# Altium project bailey-x.PrjPcb (part 4 of 8)

## Sheet MIXER.SchDoc
size Letter; DrawnBy: Titan Yuan; SheetNumber: 4; SheetTotal: 9
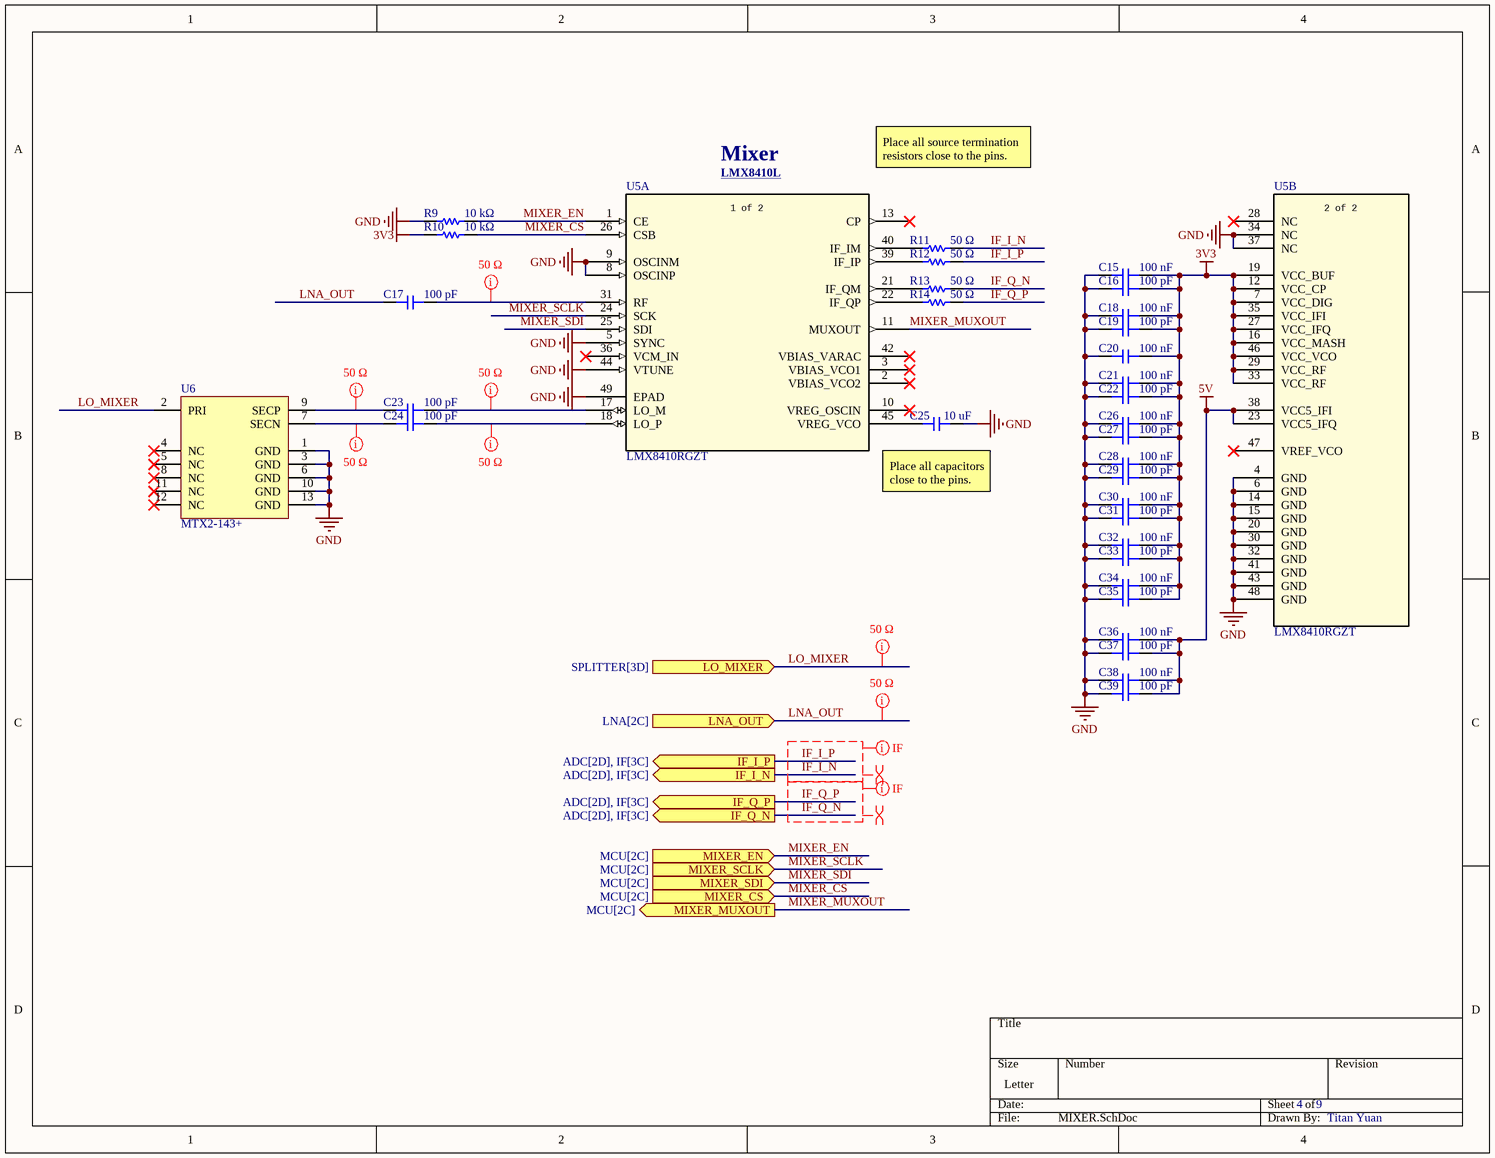
[diagram p3: MIXER.SchDoc]

### Parts
C15  100 nF  [CAP_0402]
C16  100 pF  [CAP_0402]
C17  100 pF  [CAP_0402]
C18  100 nF  [CAP_0402]
C19  100 pF  [CAP_0402]
C20  100 nF  [CAP_0402]
C21  100 nF  [CAP_0402]
C22  100 pF  [CAP_0402]
C23  100 pF  [CAP_0402]
C24  100 pF  [CAP_0402]
C25  10 uF  [CAP_0603]
C26  100 nF  [CAP_0402]
C27  100 pF  [CAP_0402]
C28  100 nF  [CAP_0402]
C29  100 pF  [CAP_0402]
C30  100 nF  [CAP_0402]
C31  100 pF  [CAP_0402]
C32  100 nF  [CAP_0402]
C33  100 pF  [CAP_0402]
C34  100 nF  [CAP_0402]
C35  100 pF  [CAP_0402]
C36  100 nF  [CAP_0402]
C37  100 pF  [CAP_0402]
C38  100 nF  [CAP_0402]
C39  100 pF  [CAP_0402]
R9  10 kΩ  [RES_0402]
R10  10 kΩ  [RES_0402]
R11  50 Ω  [RES_0402]
R12  50 Ω  [RES_0402]
R13  50 Ω  [RES_0402]
R14  50 Ω  [RES_0402]
U5  LMX8410RGZT  [RGZ48_TEX]  (parts A,B of 2)
U6  MTX2-143+  [PL-497]

### Ports
IF_I_N (out, see ADC[2D], IF[3C]), IF_I_P (out, see ADC[2D], IF[3C]), IF_Q_N (out, see ADC[2D], IF[3C]), IF_Q_P (out, see ADC[2D], IF[3C]), LNA_OUT (in, see LNA[2C]), LO_MIXER (in, see SPLITTER[3D]), MIXER_CS (in, see MCU[2C]), MIXER_EN (in, see MCU[2C]), MIXER_MUXOUT (out, see MCU[2C]), MIXER_SCLK (in, see MCU[2C]), MIXER_SDI (in, see MCU[2C])

### Nets
3V3: C15.2 C16.1 C18.2 C19.1 C20.2 C21.2 C22.1 C26.2 C27.1 C28.2 C29.1 C30.2 C31.1 C32.2 C33.1 C34.2 C35.1 R10.2 U5.7(VCC_DIG) U5.12(VCC_CP) U5.16(VCC_MASH) U5.19(VCC_BUF) U5.27(VCC_IFQ) U5.29(VCC_RF) U5.33(VCC_RF) U5.35(VCC_IFI) U5.46(VCC_VCO)
5V: C36.2 C37.1 C38.2 C39.1 U5.23(VCC5_IFQ) U5.38(VCC5_IFI)
GND: C15.1 C16.2 C18.1 C19.2 C20.1 C21.1 C22.2 C25.1 C26.1 C27.2 C28.1 C29.2 C30.1 C31.2 C32.1 C33.2 C34.1 C35.2 C36.1 C37.2 C38.1 C39.2 R9.2 U5.4(GND) U5.5(SYNC) U5.6(GND) U5.8(OSCINP) U5.9(OSCINM) U5.14(GND) U5.15(GND) U5.20(GND) U5.30(GND) U5.32(GND) U5.34(NC) U5.37(NC) U5.41(GND) U5.43(GND) U5.44(VTUNE) U5.48(GND) U5.49(EPAD) U6.1(GND) U6.3(GND) U6.6(GND) U6.10(GND) U6.13(GND)
IF_I_N: R11.1 ; port IF_I_N  [project net IF_I_EXT_N]
IF_I_P: R12.1 ; port IF_I_P  [project net IF_I_EXT_P]
IF_Q_N: R13.1 ; port IF_Q_N  [project net IF_Q_EXT_N]
IF_Q_P: R14.1 ; port IF_Q_P  [project net IF_Q_EXT_P]
LNA_OUT: C17.2 ; port LNA_OUT
LO_MIXER: U6.2(PRI) ; port LO_MIXER
MIXER_CS: R10.1 U5.26(CSB) ; port MIXER_CS
MIXER_EN: R9.1 U5.1(CE) ; port MIXER_EN
MIXER_MUXOUT: U5.11(MUXOUT) ; port MIXER_MUXOUT
MIXER_SCLK: U5.24(SCK) ; port MIXER_SCLK  [project net ADC_SPI_CLK]
MIXER_SDI: U5.25(SDI) ; port MIXER_SDI  [project net ADC_SPI_MOSI]
NetC17_1: C17.1 U5.31(RF)
NetC23_1: C23.1 U5.17(LO_M)
NetC23_2: C23.2 U6.9(SECP)
NetC24_1: C24.1 U5.18(LO_P)
NetC24_2: C24.2 U6.7(SECN)
NetC25_2: C25.2 U5.45(VREG_VCO)
NetR11_2: R11.2 U5.40(IF_IM)
NetR12_2: R12.2 U5.39(IF_IP)
NetR13_2: R13.2 U5.21(IF_QM)
NetR14_2: R14.2 U5.22(IF_QP)

Not connected (* = marked no-connect by the designer): U5 2(VBIAS_VCO2)* 3(VBIAS_VCO1)* 10(VREG_OSCIN)* 13(CP)* 28(NC)* 36(VCM_IN)* 42(VBIAS_VARAC)* 47(VREF_VCO)*; U6 4(NC)* 5(NC)* 8(NC)* 11(NC)* 12(NC)*

### Layout directives
net class 50 Ω: LNA_OUT, LO_MIXER, NetC17_1, NetC23_1, NetC23_2, NetC24_1, NetC24_2
differential pair: IF_I_N, IF_I_P, IF_Q_N, IF_Q_P
mark named IF: IF_I_N, IF_I_P, IF_Q_N, IF_Q_P

### Notes on the sheet
- Mixer
- Place all source termination resistors close to the pins.
- (near U5) LMX8410L <https://www.ti.com/product/LMX8410L>
- Place all capacitors close to the pins.
- (in symbol LMX8410RGZT, part A) 1 of 2
- (in symbol LMX8410RGZT, part B) 2 of 2

### Library data of the parts
C15 C18 C20 C21 C26 C28 C30 C32 C34 C36 C38 = CAP: Ceramic Capacitor, Ceramic, 50V, 10% +Tol, 10% -Tol, X7R, 15% TC, 0.1uF, Surface Mount, 0402; Manufacturer: Yageo; Manufacturer Part Number: CC0402KPX7R9BB104; Tolerance: +-10%; Value: 100nF; Voltage Rating: 50 V; Dielectric: Ceramic; Package Size: 0402; Supplier: DigiKey; Supplier Part Number: 13-CC0402KPX7R9BB104CT-ND; RoHS: Compliant; Category: Ceramic Capacitors; Stock: 40680; Pricing: 1=0.1, 10=0.053, 50=0.0364, 100=0.0313, 500=0.02292, 1000=0.02035, 2500=0.01764, 5000=0.01601 (USD); Case/Package: 0402; China RoHS: Compliant; Dielectric Material: Ceramic; Height: 500µm; Lead Free: Lead Free; Length: 1mm; Lifecycle Status: Production; Max Operating Temperature: 125°C; Min Operating Temperature: -55°C; Mounting Technology: Surface Mount; Number of Terminals: 2; REACH SVHC: Yes; Voltage Rating (DC): 50V; Width: 500µm; ComponentLink1URL: https://datasheet.octopart.com:443/CC0402KPX7R9BB104-Yageo-datasheet-177165144.pdf?src-supplier=IHS; ComponentLink1Description: https://datasheet.octopart.com:443/CC0402KPX7R9BB104-Yageo-datasheet-177165144.pdf?src-supplier=IHS; ComponentLink2URL: https://datasheet.octopart.com:443/CC0402KPX7R9BB104-Yageo-Group-datasheet-189192896.pdf?src-supplier=Future+Electronics; ComponentLink2Description: https://datasheet.octopart.com:443/CC0402KPX7R9BB104-Yageo-Group-datasheet-189192896.pdf?src-supplier=Future+Electronics; ComponentLink3URL: https://datasheet.octopart.com:443/CC0402KPX7R9BB104-Yageo-datasheet-181967134.pdf?src-supplier=Farnell; ComponentLink3Description: https://datasheet.octopart.com:443/CC0402KPX7R9BB104-Yageo-datasheet-181967134.pdf?src-supplier=Farnell; ComponentLink4URL: https://datasheet.octopart.com/Surface-Mount-Ceramic-Multilayer-Capacitors%3B-General-Purpose-%26-High-Capacitance-Class-2%2C-X7R-Yageo-datasheet-family-114.pdf; ComponentLink4Description: https://datasheet.octopart.com/Surface-Mount-Ceramic-Multilayer-Capacitors%3B-General-Purpose-%26-High-Capacitance-Class-2%2C-X7R-Yageo-datasheet-family-114.pdf; ComponentLink5URL: https://datasheet.octopart.com/CC0402KPX7R9BB104-Yageo-datasheet-10883670.pdf; ComponentLink5Description: https://datasheet.octopart.com/CC0402KPX7R9BB104-Yageo-datasheet-10883670.pdf; ComponentLink6URL: http://sigma.octopart.com:80/rohs_statement/Surface-Mount-Ceramic-Multilayer-Capacitors%3B-General-Purpose-%26-High-Capacitance-Class-2%2C-X7R-Yageo-family-124.pdf?src-supplier=Compliance+Statements; ComponentLink6Description: http://sigma.octopart.com:80/rohs_statement/Surface-Mount-Ceramic-Multilayer-Capacitors%3B-General-Purpose-%26-High-Capacitance-Class-2%2C-X7R-Yageo-family-124.pdf?src-supplier=Compliance+Statements; ComponentLink7URL: http://sigma.octopart.com:80/reach_statement/Surface-Mount-Ceramic-Multilayer-Capacitors%3B-General-Purpose-%26-High-Capacitance-Class-2%2C-X7R-Yageo-family-125.pdf?src-supplier=Compliance+Statements; ComponentLink7Description: http://sigma.octopart.com:80/reach_statement/Surface-Mount-Ceramic-Multilayer-Capacitors%3B-General-Purpose-%26-High-Capacitance-Class-2%2C-X7R-Yageo-family-125.pdf?src-supplier=Compliance+Statements; ComponentLink8URL: http://sigma.octopart.com:80/conflict_mineral_statement/Yageo-company-3.pdf?src-supplier=Compliance+Statements; ComponentLink8Description: http://sigma.octopart.com:80/conflict_mineral_statement/Yageo-company-3.pdf?src-supplier=Compliance+Statements; ComponentLink9URL: http://sigma.octopart.com:80/rohs_statement/Yageo-company-2.pdf?src-supplier=Compliance+Statements; ComponentLink9Description: http://sigma.octopart.com:80/rohs_statement/Yageo-company-2.pdf?src-supplier=Compliance+Statements
C16 C17 C19 C22-C24 C27 C29 C31 C33 C35 C37 C39 = CAP: 50V 100pF NP0 ±5% 0402 Multilayer Ceramic Capacitors MLCC - SMD/SMT ROHS; Manufacturer: Yageo; Manufacturer Part Number: CC0402JRNPO9BN101; Tolerance: +-5%; Insulation Resistance: 100GΩ; Temperature Coefficient: 30ppm/°C; Voltage Rating: 50 V; Dielectric: Ceramic; Package Size: 0402; Supplier: DigiKey; Supplier Part Number: 311-1024-1-ND; RoHS: Compliant; Category: Ceramic Capacitors; Stock: 3080901; Pricing: 1=0.08, 10=0.003, 10000=0.0032, 20000=0.0031, 30000=0.00304, 50000=0.00283, 70000=0.00282 (USD); Value: 100pF; Case/Package: 0402; Case Code (Imperial): 0402; Case Code (Metric): 1005; China RoHS: Compliant; Composition: Ceramic; Depth: 500µm; Dielectric Material: Ceramic; Halogen Free: Halogen Free; Height: 500µm; Lead Free: Lead Free; Length: 1mm; Lifecycle Status: Production; Max Operating Temperature: 125°C; Min Operating Temperature: -55°C; Mounting Technology: Surface Mount; Pins: 2; Number of Terminals: 2; Radiation Hardening: No; REACH SVHC: Yes; Schedule B: 8532240020, 8532240020|8532240020|8532240020|8532240020|8532240020|8532240020|8532240020|8532240020|8532240020|8532240020|8532240020|8532240020|8532240020|8532240020|8532240020|8532240020|8532240020|8532240020|8532240020|8532240020|8532240020|8532240020|8532240020|85; Termination: SMD/SMT; Thickness: 558.8µm; Voltage: 50V; Voltage Rating (AC): 50V; Voltage Rating (DC): 50V; Width: 500µm; ComponentLink1URL: https://datasheet.octopart.com:443/CC0402JRNPO9BN101-Yageo-datasheet-182140217.pdf?src-supplier=IHS; ComponentLink1Description: https://datasheet.octopart.com:443/CC0402JRNPO9BN101-Yageo-datasheet-182140217.pdf?src-supplier=IHS; ComponentLink2URL: https://datasheet.octopart.com:443/CC0402JRNPO9BN101-Yageo-datasheet-10406438.pdf?src-supplier=element14+APAC; ComponentLink2Description: https://datasheet.octopart.com:443/CC0402JRNPO9BN101-Yageo-datasheet-10406438.pdf?src-supplier=element14+APAC; ComponentLink3URL: https://datasheet.octopart.com:443/CC0402JRNPO9BN101-Yageo-datasheet-151948684.pdf?src-supplier=element14+APAC; ComponentLink3Description: https://datasheet.octopart.com:443/CC0402JRNPO9BN101-Yageo-datasheet-151948684.pdf?src-supplier=element14+APAC; ComponentLink4URL: https://datasheet.octopart.com:443/CC0402JRNPO9BN101-Yageo-datasheet-67645495.pdf?src-supplier=element14+APAC; ComponentLink4Description: https://datasheet.octopart.com:443/CC0402JRNPO9BN101-Yageo-datasheet-67645495.pdf?src-supplier=element14+APAC; ComponentLink5URL: https://datasheet.octopart.com:443/CC0402JRNPO9BN101-Yageo-datasheet-10882999.pdf?src-supplier=element14+APAC; ComponentLink5Description: https://datasheet.octopart.com:443/CC0402JRNPO9BN101-Yageo-datasheet-10882999.pdf?src-supplier=element14+APAC; ComponentLink6URL: https://datasheet.octopart.com:443/CC0402JRNPO9BN101-Yageo-datasheet-78855684.pdf?src-supplier=Upverter; ComponentLink6Description: https://datasheet.octopart.com:443/CC0402JRNPO9BN101-Yageo-datasheet-78855684.pdf?src-supplier=Upverter; ComponentLink7URL: https://datasheet.octopart.com:443/CC0402JRNPO9BN101-Yageo-Group-datasheet-188689597.pdf?src-supplier=Farnell; ComponentLink7Description: https://datasheet.octopart.com:443/CC0402JRNPO9BN101-Yageo-Group-datasheet-188689597.pdf?src-supplier=Farnell; ComponentLink8URL: https://datasheet.octopart.com:443/CC0402JRNPO9BN101-Yageo-datasheet-10621397.pdf?src-supplier=Farnell; ComponentLink8Description: https://datasheet.octopart.com:443/CC0402JRNPO9BN101-Yageo-datasheet-10621397.pdf?src-supplier=Farnell; ComponentLink9URL: https://datasheet.octopart.com:443/CC0402JRNPO9BN101-Yageo-datasheet-65873193.pdf?src-supplier=Newark; ComponentLink9Description: https://datasheet.octopart.com:443/CC0402JRNPO9BN101-Yageo-datasheet-65873193.pdf?src-supplier=Newark; ComponentLink10URL: https://datasheet.octopart.com:443/CC0402JRNPO9BN101-Yageo-datasheet-5301394.pdf?src-supplier=Newark; ComponentLink10Description: https://datasheet.octopart.com:443/CC0402JRNPO9BN101-Yageo-datasheet-5301394.pdf?src-supplier=Newark; ComponentLink11URL: https://datasheet.octopart.com:443/CC0402JRNPO9BN101-Yageo-datasheet-182966517.pdf?src-supplier=Newark; ComponentLink11Description: https://datasheet.octopart.com:443/CC0402JRNPO9BN101-Yageo-datasheet-182966517.pdf?src-supplier=Newark; ComponentLink12URL: https://datasheet.octopart.com:443/CC0402JRNPO9BN101-Yageo-datasheet-137875056.pdf?src-supplier=Future+Electronics; ComponentLink12Description: https://datasheet.octopart.com:443/CC0402JRNPO9BN101-Yageo-datasheet-137875056.pdf?src-supplier=Future+Electronics; ComponentLink13URL: https://datasheet.octopart.com:443/CC0402JRNPO9BN101-Yageo-datasheet-136957424.pdf?src-supplier=Future+Electronics; ComponentLink13Description: https://datasheet.octopart.com:443/CC0402JRNPO9BN101-Yageo-datasheet-136957424.pdf?src-supplier=Future+Electronics; ComponentLink14URL: https://datasheet.octopart.com:443/CC0402JRNPO9BN101-Yageo-datasheet-137700082.pdf?src-supplier=Future+Electronics; ComponentLink14Description: https://datasheet.octopart.com:443/CC0402JRNPO9BN101-Yageo-datasheet-137700082.pdf?src-supplier=Future+Electronics; ComponentLink15URL: https://datasheet.octopart.com:443/CC0402JRNPO9BN101-Yageo-datasheet-62126864.pdf?src-supplier=Future+Electronics; ComponentLink15Description: https://datasheet.octopart.com:443/CC0402JRNPO9BN101-Yageo-datasheet-62126864.pdf?src-supplier=Future+Electronics; ComponentLink16URL: https://datasheet.octopart.com:443/CC0402JRNPO9BN101-Yageo-datasheet-62091628.pdf?src-supplier=Future+Electronics; ComponentLink16Description: https://datasheet.octopart.com:443/CC0402JRNPO9BN101-Yageo-datasheet-62091628.pdf?src-supplier=Future+Electronics; ComponentLink17URL: https://datasheet.octopart.com:443/CC0402JRNPO9BN101-Yageo-datasheet-24578986.pdf?src-supplier=Future+Electronics; ComponentLink17Description: https://datasheet.octopart.com:443/CC0402JRNPO9BN101-Yageo-datasheet-24578986.pdf?src-supplier=Future+Electronics; ComponentLink18URL: https://datasheet.octopart.com:443/CC0402JRNPO9BN101-Yageo-datasheet-16730043.pdf?src-supplier=Future+Electronics; ComponentLink18Description: https://datasheet.octopart.com:443/CC0402JRNPO9BN101-Yageo-datasheet-16730043.pdf?src-supplier=Future+Electronics; ComponentLink19URL: https://datasheet.octopart.com:443/CC0402JRNPO9BN101-Yageo-datasheet-12589826.pdf?src-supplier=Future+Electronics; ComponentLink19Description: https://datasheet.octopart.com:443/CC0402JRNPO9BN101-Yageo-datasheet-12589826.pdf?src-supplier=Future+Electronics; ComponentLink20URL: https://datasheet.octopart.com:443/CC0402JRNPO9BN101-Yageo-datasheet-8817079.pdf?src-supplier=element14; ComponentLink20Description: https://datasheet.octopart.com:443/CC0402JRNPO9BN101-Yageo-datasheet-8817079.pdf?src-supplier=element14; ComponentLink21URL: https://datasheet.octopart.com:443/CC0402JRNPO9BN101-Yageo-datasheet-8324240.pdf?src-supplier=element14; ComponentLink21Description: https://datasheet.octopart.com:443/CC0402JRNPO9BN101-Yageo-datasheet-8324240.pdf?src-supplier=element14; ComponentLink22URL: https://datasheet.octopart.com:443/CC0402JRNPO9BN101-Yageo-datasheet-504625.pdf?src-supplier=element14; ComponentLink22Description: https://datasheet.octopart.com:443/CC0402JRNPO9BN101-Yageo-datasheet-504625.pdf?src-supplier=element14; ComponentLink23URL: https://datasheet.octopart.com:443/CC0402JRNPO9BN101-Yageo-datasheet-5321569.pdf?src-supplier=element14; ComponentLink23Description: https://datasheet.octopart.com:443/CC0402JRNPO9BN101-Yageo-datasheet-5321569.pdf?src-supplier=element14; ComponentLink24URL: https://datasheet.octopart.com:443/CC0402JRNPO9BN101-Yageo-datasheet-68296204.pdf?src-supplier=Megastar; ComponentLink24Description: https://datasheet.octopart.com:443/CC0402JRNPO9BN101-Yageo-datasheet-68296204.pdf?src-supplier=Megastar; ComponentLink25URL: http://sigma.octopart.com:80/conflict_mineral_statement/Yageo-company-3.pdf?src-supplier=Compliance+Statements; ComponentLink25Description: http://sigma.octopart.com:80/conflict_mineral_statement/Yageo-company-3.pdf?src-supplier=Compliance+Statements; ComponentLink26URL: http://sigma.octopart.com:80/rohs_statement/Yageo-company-2.pdf?src-supplier=Compliance+Statements; ComponentLink26Description: http://sigma.octopart.com:80/rohs_statement/Yageo-company-2.pdf?src-supplier=Compliance+Statements
C25 = CAP: 10V 10uF X7R ±10% 0603 Multilayer Ceramic Capacitors MLCC - SMD/SMT ROHS; Manufacturer: Murata Electronics; Manufacturer Part Number: GRM188Z71A106KA73D; Manufacturer Lifecycle Status: IN PRODUCTION; Tolerance: +-10%; Value: 10µF; Voltage Rating: 10 V; Dielectric: Ceramic; Package Size: 0603; Supplier: DigiKey; Supplier Part Number: 490-GRM188Z71A106KA73DCT-ND; RoHS: Compliant; Category: Ceramic Capacitors; Stock: 395206; Pricing: 1=0.24, 10=0.141, 50=0.1016, 100=0.0903, 500=0.0767, 1000=0.07013 (USD); Case/Package: 0603; Dielectric Material: Ceramic; Export Control Classification Number (ECCN) Code: EAR99; Height: 800µm; Harmonized Tariff Schedule (HTS) Code: 8532.24.00.20; Introduction Date: 2017-02-21; Length: 1.6mm; Lifecycle Status: Production; Material: Ceramic; Max Operating Temperature: 125°C; Min Operating Temperature: -55°C; Mounting Technology: Surface Mount; Number of Terminals: 2; REACH SVHC: Yes; Schedule B: 8532240020, 8532240020|8532240020|8532240020|8532240020|8532240020; Thickness: 800µm; Voltage Rating (DC): 10V; Width: 800µm; ComponentLink1URL: https://datasheet.octopart.com:443/GRM188Z71A106KA73D-Murata-datasheet-141276001.pdf?src-supplier=Geoflip; ComponentLink1Description: https://datasheet.octopart.com:443/GRM188Z71A106KA73D-Murata-datasheet-141276001.pdf?src-supplier=Geoflip; ComponentLink2URL: https://datasheet.octopart.com:443/GRM188Z71A106KA73D-Murata-datasheet-165579666.pdf?src-supplier=TME; ComponentLink2Description: https://datasheet.octopart.com:443/GRM188Z71A106KA73D-Murata-datasheet-165579666.pdf?src-supplier=TME; ComponentLink3URL: https://datasheet.octopart.com:443/GRM188Z71A106KA73D-Murata-datasheet-140705911.pdf?src-supplier=Ciiva; ComponentLink3Description: https://datasheet.octopart.com:443/GRM188Z71A106KA73D-Murata-datasheet-140705911.pdf?src-supplier=Ciiva; ComponentLink4URL: https://datasheet.octopart.com:443/GRM188Z71A106KA73D-Murata-datasheet-138743429.pdf?src-supplier=Ciiva; ComponentLink4Description: https://datasheet.octopart.com:443/GRM188Z71A106KA73D-Murata-datasheet-138743429.pdf?src-supplier=Ciiva; ComponentLink5URL: http://sigma.octopart.com:80/reach_statement/Murata-company-16.pdf?src-supplier=Compliance+Statements; ComponentLink5Description: http://sigma.octopart.com:80/reach_statement/Murata-company-16.pdf?src-supplier=Compliance+Statements
R9 R10 = RES: Res Thick Film 0402 10K Ohm 1% 0.063W(1/16W) ±100ppm/C Pad SMD T/R; Manufacturer: Yageo; Manufacturer Part Number: RC0402FR-0710KL; Power Dissipation: 62.5mW; Power Rating: 63mW; Value: 10kΩ; Temperature Coefficient: 100ppm/°C; Voltage Rating: 50V; Tolerance: 1%; Package Size: 0402; Supplier: DigiKey; Supplier Part Number: 311-10.0KLRCT-ND; RoHS: Compliant; Category: Chip SMD Resistors; Stock: 9059080; Pricing: 1=0.1, 10=0.012, 25=0.0092, 50=0.0062, 100=0.0056, 250=0.00472, 500=0.00328, 10000=0.00204, 20000=0.00153 (USD); Case/Package: 0402; Case Code (Imperial): 0402; Case Code (Metric): 0402; China RoHS: Non-Compliant; Composition: Thick Film; Country of Origin: Mainland China, Taiwan; Depth: 500µm; Export Control Classification Number (ECCN) Code: EAR99; Height: 350µm; Harmonized Tariff Schedule (HTS) Code: 8533.21.00.30; Introduction Date: 2004-10-04; Lead Free: Lead Free; Lead Pitch: 200µm; Length: 1mm; Lifecycle Status: Production; Max Operating Temperature: 155°C; Military Standard: Not; Min Operating Temperature: -55°C; Mounting Technology: Surface Mount; Pins: 2; Number of Terminals: 2; Number of Terminations: 2; Packaging: Tape & Reel; REACH SVHC: Yes; Schedule B: 8533210045, 8533210045|8533210045|8533210045|8533210045|8533210045|8533210045|8533210045|8533210045|8533210045|8533210045|8533210045|8533210045|8533210045|8533210045, 8533210045|8533210045|8533210045|8533210045|8533210045|8533210045|8533210045|8533210045|8533210045|8533210045|8533210045|8533210045|8533210045|8533210045|8533210045, 8533210045|8533210045|8533210045|8533210045|8533210045|8533210045|8533210045|8533210045|8533210045|8533210045|8533210045|8533210045|8533210045|8533210045|8533210045|8533210045; Termination: SMD/SMT; Voltage Rating (DC): 50V; Width: 500µm; Working Voltage: 50V; ComponentLink1URL: https://datasheet.octopart.com:443/RC0402FR-0710KL-Yageo-datasheet-175887523.pdf?src-supplier=Newark; ComponentLink1Description: https://datasheet.octopart.com:443/RC0402FR-0710KL-Yageo-datasheet-175887523.pdf?src-supplier=Newark; ComponentLink2URL: https://datasheet.octopart.com:443/RC0402FR-0710KL-Yageo-datasheet-12531192.pdf?src-supplier=Newark; ComponentLink2Description: https://datasheet.octopart.com:443/RC0402FR-0710KL-Yageo-datasheet-12531192.pdf?src-supplier=Newark; ComponentLink3URL: https://datasheet.octopart.com:443/RC0402FR-0710KL-Yageo-datasheet-8324527.pdf?src-supplier=Newark; ComponentLink3Description: https://datasheet.octopart.com:443/RC0402FR-0710KL-Yageo-datasheet-8324527.pdf?src-supplier=Newark; ComponentLink4URL: https://datasheet.octopart.com:443/RC0402FR-0710KL-Yageo-datasheet-10408619.pdf?src-supplier=element14+APAC; ComponentLink4Description: https://datasheet.octopart.com:443/RC0402FR-0710KL-Yageo-datasheet-10408619.pdf?src-supplier=element14+APAC; ComponentLink5URL: https://datasheet.octopart.com:443/RC0402FR-0710KL-Yageo-datasheet-62067350.pdf?src-supplier=element14+APAC; ComponentLink5Description: https://datasheet.octopart.com:443/RC0402FR-0710KL-Yageo-datasheet-62067350.pdf?src-supplier=element14+APAC; ComponentLink6URL: https://datasheet.octopart.com:443/RC0402FR-0710KL-Yageo-datasheet-21426659.pdf?src-supplier=element14+APAC; ComponentLink6Description: https://datasheet.octopart.com:443/RC0402FR-0710KL-Yageo-datasheet-21426659.pdf?src-supplier=element14+APAC; ComponentLink7URL: https://datasheet.octopart.com:443/RC0402FR-0710KL-Yageo-datasheet-164759695.pdf?src-supplier=Upverter; ComponentLink7Description: https://datasheet.octopart.com:443/RC0402FR-0710KL-Yageo-datasheet-164759695.pdf?src-supplier=Upverter; ComponentLink8URL: https://datasheet.octopart.com:443/RC0402FR-0710KL-Yageo-datasheet-103092701.pdf?src-supplier=Upverter; ComponentLink8Description: https://datasheet.octopart.com:443/RC0402FR-0710KL-Yageo-datasheet-103092701.pdf?src-supplier=Upverter; ComponentLink9URL: https://sigma.octopart.com:443/138820526/technical_drawing/Yageo-RC0402FR-0710KL.pdf?src-supplier=Upverter; ComponentLink9Description: https://sigma.octopart.com:443/138820526/technical_drawing/Yageo-RC0402FR-0710KL.pdf?src-supplier=Upverter; ComponentLink10URL: https://datasheet.octopart.com:443/RC0402FR-0710KL-Yageo-datasheet-98239111.pdf?src-supplier=Upverter; ComponentLink10Description: https://datasheet.octopart.com:443/RC0402FR-0710KL-Yageo-datasheet-98239111.pdf?src-supplier=Upverter; ComponentLink11URL: https://datasheet.octopart.com:443/RC0402FR-0710KL-Yageo-datasheet-68298067.pdf?src-supplier=Upverter; ComponentLink11Description: https://datasheet.octopart.com:443/RC0402FR-0710KL-Yageo-datasheet-68298067.pdf?src-supplier=Upverter; ComponentLink12URL: https://datasheet.octopart.com:443/RC0402FR-0710KL-Yageo-datasheet-68297981.pdf?src-supplier=Upverter; ComponentLink12Description: https://datasheet.octopart.com:443/RC0402FR-0710KL-Yageo-datasheet-68297981.pdf?src-supplier=Upverter; ComponentLink13URL: https://datasheet.octopart.com:443/RC0402FR-0710KL-Yageo-datasheet-141435361.pdf?src-supplier=Upverter; ComponentLink13Description: https://datasheet.octopart.com:443/RC0402FR-0710KL-Yageo-datasheet-141435361.pdf?src-supplier=Upverter; ComponentLink14URL: https://datasheet.octopart.com:443/RC0402FR-0710KL-Yageo-datasheet-12509768.pdf?src-supplier=Upverter; ComponentLink14Description: https://datasheet.octopart.com:443/RC0402FR-0710KL-Yageo-datasheet-12509768.pdf?src-supplier=Upverter; ComponentLink15URL: https://datasheet.octopart.com:443/RC0402FR-0710KL-Yageo-Group-datasheet-190305687.pdf?src-supplier=Future+Electronics; ComponentLink15Description: https://datasheet.octopart.com:443/RC0402FR-0710KL-Yageo-Group-datasheet-190305687.pdf?src-supplier=Future+Electronics; ComponentLink16URL: https://datasheet.octopart.com:443/RC0402FR-0710KL-Yageo-datasheet-137700087.pdf?src-supplier=Future+Electronics; ComponentLink16Description: https://datasheet.octopart.com:443/RC0402FR-0710KL-Yageo-datasheet-137700087.pdf?src-supplier=Future+Electronics; ComponentLink17URL: https://datasheet.octopart.com:443/RC0402FR-0710KL-Yageo-datasheet-8324255.pdf?src-supplier=Future+Electronics; ComponentLink17Description: https://datasheet.octopart.com:443/RC0402FR-0710KL-Yageo-datasheet-8324255.pdf?src-supplier=Future+Electronics; ComponentLink18URL: https://datasheet.octopart.com:443/RC0402FR-0710KL-Yageo-datasheet-8329306.pdf?src-supplier=element14; ComponentLink18Description: https://datasheet.octopart.com:443/RC0402FR-0710KL-Yageo-datasheet-8329306.pdf?src-supplier=element14; ComponentLink19URL: https://datasheet.octopart.com:443/RC0402FR-0710KL-Yageo-datasheet-505231.pdf?src-supplier=element14; ComponentLink19Description: https://datasheet.octopart.com:443/RC0402FR-0710KL-Yageo-datasheet-505231.pdf?src-supplier=element14; ComponentLink20URL: https://datasheet.octopart.com:443/RC0402FR-0710KL-Yageo-datasheet-175423674.pdf?src-supplier=SOS+electronic; ComponentLink20Description: https://datasheet.octopart.com:443/RC0402FR-0710KL-Yageo-datasheet-175423674.pdf?src-supplier=SOS+electronic; ComponentLink21URL: https://datasheet.octopart.com:443/RC0402FR-0710KL-Yageo-datasheet-79472498.pdf?src-supplier=Megastar; ComponentLink21Description: https://datasheet.octopart.com:443/RC0402FR-0710KL-Yageo-datasheet-79472498.pdf?src-supplier=Megastar; ComponentLink22URL: https://datasheet.octopart.com/RC0402FR-0710KL-Yageo-datasheet-73766026.pdf; ComponentLink22Description: https://datasheet.octopart.com/RC0402FR-0710KL-Yageo-datasheet-73766026.pdf; ComponentLink23URL: http://sigma.octopart.com:80/conflict_mineral_statement/Yageo-company-3.pdf?src-supplier=Compliance+Statements; ComponentLink23Description: http://sigma.octopart.com:80/conflict_mineral_statement/Yageo-company-3.pdf?src-supplier=Compliance+Statements; ComponentLink24URL: http://sigma.octopart.com:80/rohs_statement/Yageo-company-2.pdf?src-supplier=Compliance+Statements; ComponentLink24Description: http://sigma.octopart.com:80/rohs_statement/Yageo-company-2.pdf?src-supplier=Compliance+Statements
R11-R14 = RES: 62.5mW Thin Film Resistor ±50ppm/℃ ±0.1% 50Ω 0402 Chip Resistor - Surface Mount ROHS; Manufacturer: Yageo; Manufacturer Part Number: RT0402BRE0750RL; Tolerance: +-0.1%; Power Rating: 1/16 W; Max Power Dissipation: 63mW; Temperature Coefficient: 50ppm/°C; Voltage Rating: 50V; Package Size: 0402; Supplier: DigiKey; Supplier Part Number: 13-RT0402BRE0750RLCT-ND; RoHS: Compliant; Category: Chip SMD Resistors; Stock: 104846; Pricing: 1=0.18, 10=0.076, 25=0.074, 50=0.0714, 100=0.0663, 250=0.05816, 500=0.0561, 1000=0.04564, 10000=0.05508, 20000=0.05304, 30000=0.04099, 50000=0.03992, 70000=0.03927, 100000=0.03862, 120000=0.03831, 240000=0.03778 (USD); Case/Package: 0402; China RoHS: Non-Compliant; Composition: Thin Film; Country of Origin: Mainland China; Export Control Classification Number (ECCN) Code: EAR99; Features: Moisture Resistant; Height: 350µm; Harmonized Tariff Schedule (HTS) Code: 8533.21.00.30; Introduction Date: 2017-09-12; Length: 990.6µm; Lifecycle Status: Production; Max Operating Temperature: 155°C; Min Operating Temperature: -55°C; Mounting Technology: Surface Mount; Number of Terminals: 2; Number of Terminations: 2; Packaging: Tape & Reel; Power Dissipation: 62.5mW; REACH SVHC: Yes; Value: 50Ω; Width: 508µm; Working Voltage: 50V; ComponentLink1URL: https://datasheet.octopart.com:443/RT0402BRE0750RL-Yageo-datasheet-169971040.pdf?src-supplier=Upverter; ComponentLink1Description: https://datasheet.octopart.com:443/RT0402BRE0750RL-Yageo-datasheet-169971040.pdf?src-supplier=Upverter; ComponentLink2URL: https://sigma.octopart.com:443/138820526/technical_drawing/Yageo-RT0402BRE0750RL.pdf?src-supplier=Upverter; ComponentLink2Description: https://sigma.octopart.com:443/138820526/technical_drawing/Yageo-RT0402BRE0750RL.pdf?src-supplier=Upverter; ComponentLink3URL: https://datasheet.octopart.com:443/RT0402BRE0750RL-Yageo-datasheet-96443642.pdf?src-supplier=IHS; ComponentLink3Description: https://datasheet.octopart.com:443/RT0402BRE0750RL-Yageo-datasheet-96443642.pdf?src-supplier=IHS; ComponentLink4URL: https://datasheet.octopart.com:443/RT0402BRE0750RL-Yageo-datasheet-176402239.pdf?src-supplier=Future+Electronics; ComponentLink4Description: https://datasheet.octopart.com:443/RT0402BRE0750RL-Yageo-datasheet-176402239.pdf?src-supplier=Future+Electronics; ComponentLink5URL: https://datasheet.octopart.com:443/RT0402BRE0750RL-Yageo-datasheet-166250672.pdf?src-supplier=Future+Electronics; ComponentLink5Description: https://datasheet.octopart.com:443/RT0402BRE0750RL-Yageo-datasheet-166250672.pdf?src-supplier=Future+Electronics; ComponentLink6URL: https://datasheet.octopart.com:443/RT0402BRE0750RL-Yageo-datasheet-141265893.pdf?src-supplier=ODG+(Origin+Data+Global); ComponentLink6Description: https://datasheet.octopart.com:443/RT0402BRE0750RL-Yageo-datasheet-141265893.pdf?src-supplier=ODG+(Origin+Data+Global); ComponentLink7URL: https://datasheet.octopart.com/RT0402BRE0750RL-Yageo-datasheet-86813807.pdf; ComponentLink7Description: https://datasheet.octopart.com/RT0402BRE0750RL-Yageo-datasheet-86813807.pdf; ComponentLink8URL: http://sigma.octopart.com:80/conflict_mineral_statement/Yageo-company-3.pdf?src-supplier=Compliance+Statements; ComponentLink8Description: http://sigma.octopart.com:80/conflict_mineral_statement/Yageo-company-3.pdf?src-supplier=Compliance+Statements; ComponentLink9URL: http://sigma.octopart.com:80/rohs_statement/Yageo-company-2.pdf?src-supplier=Compliance+Statements; ComponentLink9Description: http://sigma.octopart.com:80/rohs_statement/Yageo-company-2.pdf?src-supplier=Compliance+Statements
U5 = LMX8410RGZT: 4GHz~10GHz 19dB 11dB QFN-48-EP(7x7) RF Modulators / Demodulator ROHS; Manufacturer_Name: Texas Instruments; Manufacturer Lifecycle Status: ACTIVE; Frequency: 10GHz; Copyright: Copyright (C) 2026 Ultra Librarian. All rights reserved.; Manufacturer_Part_Number: LMX8410RGZT; Datasheet: https://www.ti.com/lit/gpn/lmx8410l; RefDes: RefDes; Type: Type; Supplier: DigiKey; Supplier Part Number: 296-53223-1-ND; Manufacturer: Texas Instruments; Manufacturer Part Number: LMX8410RGZT; RoHS: Compliant; Category: RF Receivers, Transceivers; Stock: 564; Pricing: 1=134.16, 10=113.249, 25=108.0276 (USD); Case/Package: VQFN; Height: 1mm; Length: 7mm; Lifecycle Status: Production; Pins: 48; Schedule B: 8542390000, 8542390000|8542390000|8542390000|8542390000|8542390000; Thickness: 900µm; Width: 7mm; ComponentLink1URL: https://sigma.octopart.com:443/49249797/technical_drawing/Texas-Instruments-LMX8410RGZT.pdf?src-supplier=Texas+Instruments; ComponentLink1Description: https://sigma.octopart.com:443/49249797/technical_drawing/Texas-Instruments-LMX8410RGZT.pdf?src-supplier=Texas+Instruments; ComponentLink2URL: https://octopart.com:443/opatz8j6/c1?t=OSmSJJdNyKSbWqEw0vn8SIgfjq11nLHjtGgfLHRXvwfeMgF3TY_W6V8cFA1iHYYIOxC0JB7bHbIc4ZhsozsVMJli3TD6MJfYLuuyT7qGQcay5ot-dpFL0YZnHF23ZUpECGlIaOqZYS-_--WhL5WwkmL1f5pSpJKV6lYnSunmmDMtuF41zkfeYuxpGUnPa8VU9glOm5OV5MJuk4URxeiUVA1vu6wi3GZ-eSUaVnHSNvkDjkEVzksepbqIECkZ51v6n-bDohaiCp0rJydrV8ZXqdVDfu5t9teVCchDSMKaAW-RKjs78W6r6rYCspQdRpOoggdynM_4PcQHvtaA5v4WWRiyBUJ58a966Hsb4g0B5WZD8S-QOJnlBY18ViVbJ0UPjo9Qt7-Z&src-supplier=Texas+Instruments; ComponentLink2Description: https://octopart.com:443/opatz8j6/c1?t=OSmSJJdNyKSbWqEw0vn8SIgfjq11nLHjtGgfLHRXvwfeMgF3TY_W6V8cFA1iHYYIOxC0JB7bHbIc4ZhsozsVMJli3TD6MJfYLuuyT7qGQcay5ot-dpFL0YZnHF23ZUpECGlIaOqZYS-_--WhL5WwkmL1f5pSpJKV6lYnSunmmDMtuF41zkfeYuxpGUnPa8VU9glOm5OV5MJuk4URxeiUVA1vu6wi3GZ-eSUaVnHSNvkDjkEVzksepbqIECkZ51v6n-bDohaiCp0rJydrV8ZXqdVDfu5t9teVCchDSMKaAW-RKjs78W6r6rYCspQdRpOoggdynM_4PcQHvtaA5v4WWRiyBUJ58a966Hsb4g0B5WZD8S-QOJnlBY18ViVbJ0UPjo9Qt7-Z&src-supplier=Texas+Instruments; ComponentLink3URL: https://datasheet.octopart.com:443/LMX8410RGZT-Texas-Instruments-datasheet-166594463.pdf?src-supplier=Augswan; ComponentLink3Description: https://datasheet.octopart.com:443/LMX8410RGZT-Texas-Instruments-datasheet-166594463.pdf?src-supplier=Augswan; ComponentLink4URL: http://sigma.octopart.com:80/reach_statement/Texas-Instruments-company-64.pdf?src-supplier=Compliance+Statements; ComponentLink4Description: http://sigma.octopart.com:80/reach_statement/Texas-Instruments-company-64.pdf?src-supplier=Compliance+Statements; ComponentLink5URL: http://sigma.octopart.com:80/conflict_mineral_statement/Texas-Instruments-company-63.pdf?src-supplier=Compliance+Statements; ComponentLink5Description: http://sigma.octopart.com:80/conflict_mineral_statement/Texas-Instruments-company-63.pdf?src-supplier=Compliance+Statements
U6 = MTX2-143+: RF Transformer, 5500MHz Min; Manufacturer: Mini-Circuits; Insertion Loss (dB): 2.5dB; Manufacturer Part Number: MTX2-143+; Supplier: DigiKey; Supplier Part Number: 3157-MTX2-143+CT-ND; RoHS: Compliant; Category: Transformers; Stock: 559; Pricing: 1=16.09, 20=3.7485 (USD); Export Control Classification Number (ECCN) Code: EAR99; Height: 890µm; Introduction Date: 2017-08-24; Length: 3mm; Lifecycle Status: Production; Max Operating Temperature: 85°C; Min Operating Temperature: -40°C; Mounting Technology: Surface Mount; Width: 3mm; ComponentLink1URL: https://datasheet.octopart.com:443/MTX2-143%2B-Mini-Circuits-datasheet-180702081.pdf?src-supplier=IHS; ComponentLink1Description: https://datasheet.octopart.com:443/MTX2-143%2B-Mini-Circuits-datasheet-180702081.pdf?src-supplier=IHS

## Sheet IF.SchDoc
size Letter; DrawnBy: Titan Yuan; SheetNumber: 5; SheetTotal: 9
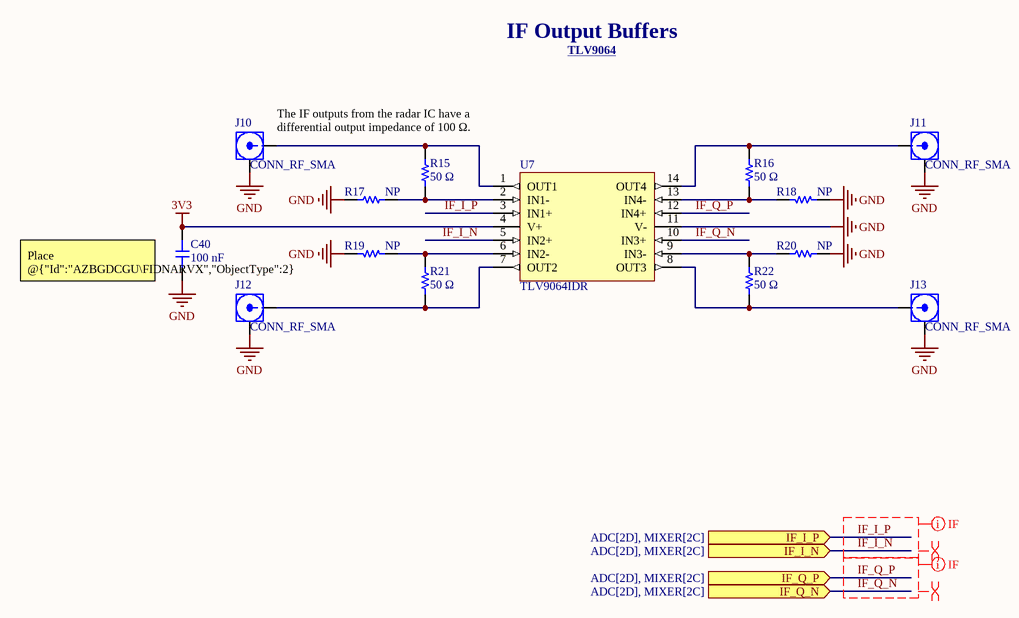
[diagram p4: IF.SchDoc]

### Parts
C40  100 nF  [CAP_0402]
J10  CONN_RF_SMA  [SMA-J-P-H-ST-TH1]
J11  CONN_RF_SMA  [SMA-J-P-H-ST-TH1]
J12  CONN_RF_SMA  [SMA-J-P-H-ST-TH1]
J13  CONN_RF_SMA  [SMA-J-P-H-ST-TH1]
R15  50 Ω  [RES_0603]
R16  50 Ω  [RES_0603]
R17  NP  [RES_0603]
R18  NP  [RES_0603]
R19  NP  [RES_0603]
R20  NP  [RES_0603]
R21  50 Ω  [RES_0603]
R22  50 Ω  [RES_0603]
U7  TLV9064IDR  [TLV9064IDR]

### Ports
IF_I_N (in, see ADC[2D], MIXER[2C]), IF_I_P (in, see ADC[2D], MIXER[2C]), IF_Q_N (in, see ADC[2D], MIXER[2C]), IF_Q_P (in, see ADC[2D], MIXER[2C])

### Nets
3V3: C40.2 U7.4(V+)
GND: C40.1 J10.2 J11.2 J12.2 J13.2 R17.2 R18.2 R19.2 R20.2 U7.11(V-)
IF_I_N: U7.5(IN2+) ; port IF_I_N  [project net IF_I_EXT_N]
IF_I_P: U7.3(IN1+) ; port IF_I_P  [project net IF_I_EXT_P]
IF_Q_N: U7.10(IN3+) ; port IF_Q_N  [project net IF_Q_EXT_N]
IF_Q_P: U7.12(IN4+) ; port IF_Q_P  [project net IF_Q_EXT_P]
NetJ10_1: J10.1 R15.2 U7.1(OUT1)
NetJ11_1: J11.1 R16.2 U7.14(OUT4)
NetJ12_1: J12.1 R21.2 U7.7(OUT2)
NetJ13_1: J13.1 R22.2 U7.8(OUT3)
NetR15_1: R15.1 R17.1 U7.2(IN1-)
NetR16_1: R16.1 R18.1 U7.13(IN4-)
NetR19_1: R19.1 R21.1 U7.6(IN2-)
NetR20_1: R20.1 R22.1 U7.9(IN3-)

### Layout directives
differential pair: IF_I_N, IF_I_P, IF_Q_N, IF_Q_P
mark named IF: IF_I_N, IF_I_P, IF_Q_N, IF_Q_P

### Notes on the sheet
- IF Output Buffers
- TLV9064 <https://www.ti.com/product/TLV9064>
- The IF outputs from the radar IC have a differential output impedance of 100 Ω.
- (near C40) Place @{"Id":"AZBGDCGU\FIDNARVX","ObjectType":2} as close to the device as possible.

### Library data of the parts
C40 = CAP: as C15 on sheet MIXER; Voltage Rating: 50 V; Dielectric: Ceramic; Package Size: 0402; Supplier: DigiKey; Supplier Part Number: 13-CC0402KPX7R9BB104CT-ND; RoHS: Compliant; Category: Ceramic Capacitors; Stock: 40680; Pricing: 1=0.1, 10=0.053, 50=0.0364, 100=0.0313, 500=0.02292, 1000=0.02035, 2500=0.01764, 5000=0.01601 (USD); Case/Package: 0402; China RoHS: Compliant; Dielectric Material: Ceramic; Height: 500µm; Lead Free: Lead Free; Length: 1mm; Lifecycle Status: Production; Max Operating Temperature: 125°C; Min Operating Temperature: -55°C; Mounting Technology: Surface Mount; Number of Terminals: 2; REACH SVHC: Yes; Voltage Rating (DC): 50V; Width: 500µm; ComponentLink1URL: https://datasheet.octopart.com:443/CC0402KPX7R9BB104-Yageo-datasheet-177165144.pdf?src-supplier=IHS; ComponentLink1Description: https://datasheet.octopart.com:443/CC0402KPX7R9BB104-Yageo-datasheet-177165144.pdf?src-supplier=IHS; ComponentLink2URL: https://datasheet.octopart.com:443/CC0402KPX7R9BB104-Yageo-Group-datasheet-189192896.pdf?src-supplier=Future+Electronics; ComponentLink2Description: https://datasheet.octopart.com:443/CC0402KPX7R9BB104-Yageo-Group-datasheet-189192896.pdf?src-supplier=Future+Electronics; ComponentLink3URL: https://datasheet.octopart.com:443/CC0402KPX7R9BB104-Yageo-datasheet-181967134.pdf?src-supplier=Farnell; ComponentLink3Description: https://datasheet.octopart.com:443/CC0402KPX7R9BB104-Yageo-datasheet-181967134.pdf?src-supplier=Farnell; ComponentLink4URL: https://datasheet.octopart.com/Surface-Mount-Ceramic-Multilayer-Capacitors%3B-General-Purpose-%26-High-Capacitance-Class-2%2C-X7R-Yageo-datasheet-family-114.pdf; ComponentLink4Description: https://datasheet.octopart.com/Surface-Mount-Ceramic-Multilayer-Capacitors%3B-General-Purpose-%26-High-Capacitance-Class-2%2C-X7R-Yageo-datasheet-family-114.pdf; ComponentLink5URL: https://datasheet.octopart.com/CC0402KPX7R9BB104-Yageo-datasheet-10883670.pdf; ComponentLink5Description: https://datasheet.octopart.com/CC0402KPX7R9BB104-Yageo-datasheet-10883670.pdf; ComponentLink6URL: http://sigma.octopart.com:80/rohs_statement/Surface-Mount-Ceramic-Multilayer-Capacitors%3B-General-Purpose-%26-High-Capacitance-Class-2%2C-X7R-Yageo-family-124.pdf?src-supplier=Compliance+Statements; ComponentLink6Description: http://sigma.octopart.com:80/rohs_statement/Surface-Mount-Ceramic-Multilayer-Capacitors%3B-General-Purpose-%26-High-Capacitance-Class-2%2C-X7R-Yageo-family-124.pdf?src-supplier=Compliance+Statements; ComponentLink7URL: http://sigma.octopart.com:80/reach_statement/Surface-Mount-Ceramic-Multilayer-Capacitors%3B-General-Purpose-%26-High-Capacitance-Class-2%2C-X7R-Yageo-family-125.pdf?src-supplier=Compliance+Statements; ComponentLink7Description: http://sigma.octopart.com:80/reach_statement/Surface-Mount-Ceramic-Multilayer-Capacitors%3B-General-Purpose-%26-High-Capacitance-Class-2%2C-X7R-Yageo-family-125.pdf?src-supplier=Compliance+Statements; ComponentLink8URL: http://sigma.octopart.com:80/conflict_mineral_statement/Yageo-company-3.pdf?src-supplier=Compliance+Statements; ComponentLink8Description: http://sigma.octopart.com:80/conflict_mineral_statement/Yageo-company-3.pdf?src-supplier=Compliance+Statements; ComponentLink9URL: http://sigma.octopart.com:80/rohs_statement/Yageo-company-2.pdf?src-supplier=Compliance+Statements; ComponentLink9Description: http://sigma.octopart.com:80/rohs_statement/Yageo-company-2.pdf?src-supplier=Compliance+Statements
J10-J13 = CONN_RF_SMA: RF / Coaxial Connector, SMA Coaxial, Straight Jack, Through Hole Vertical, 50 ohm; Manufacturer: Samtec; Manufacturer Lifecycle Status: PRODUCTION; Maximum Frequency: 20 GHz; Body Material: Brass; Body Plating: Gold; Connector Type: SMA, Socket; Dielectric Material: PTFE; Frequency: 20GHz; Gender: Female; Impedance: 50Ω; Clock Frequency: 6GHz; Number of Contacts: 1; Voltage Rating: 335V; Manufacturer Part Number: SMA-J-P-H-ST-TH1; Supplier: DigiKey; Supplier Part Number: SAM8971-ND; RoHS: Compliant; Category: RF / Coaxial Connectors; Stock: 25259; Pricing: 1=2.75, 10=2.333, 25=2.1864, 50=2.0818, 100=1.9823, 250=1.85816, 500=1.76948, 1000=1.68505, 2500=1.584 (USD); Case/Package: SMA; Contact Material: Gold; Contact Plating: Gold; Depth: 7mm; Fastening Type: Threaded; Height: 9.81mm; Housing Color: Gold; Insulation Material: Polytetrafluoroethylene; Length: 7mm; Lifecycle Status: Production; Max Operating Temperature: 125°C; Min Operating Temperature: -65°C; Mounting Technology: Flanges, Panel, Through Hole; Orientation: Straight; Radiation Hardening: No; Termination: Solder; ComponentLink1URL: https://datasheet.octopart.com:443/SMA-J-P-H-ST-TH1-Samtec-datasheet-104427088.pdf?src-supplier=Upverter; ComponentLink1Description: https://datasheet.octopart.com:443/SMA-J-P-H-ST-TH1-Samtec-datasheet-104427088.pdf?src-supplier=Upverter; ComponentLink2URL: https://sigma.octopart.com:443/97281565/technical_drawing/Samtec-SMA-J-P-H-ST-TH1.pdf?src-supplier=Upverter; ComponentLink2Description: https://sigma.octopart.com:443/97281565/technical_drawing/Samtec-SMA-J-P-H-ST-TH1.pdf?src-supplier=Upverter; ComponentLink3URL: https://datasheet.octopart.com:443/SMA-J-P-H-ST-TH1-Samtec-datasheet-97281556.pdf?src-supplier=Electro+Sonic; ComponentLink3Description: https://datasheet.octopart.com:443/SMA-J-P-H-ST-TH1-Samtec-datasheet-97281556.pdf?src-supplier=Electro+Sonic; ComponentLink4URL: https://datasheet.octopart.com:443/SMA-J-P-H-ST-TH1-Samtec-datasheet-157420883.pdf?src-supplier=Newark; ComponentLink4Description: https://datasheet.octopart.com:443/SMA-J-P-H-ST-TH1-Samtec-datasheet-157420883.pdf?src-supplier=Newark; ComponentLink5URL: https://datasheet.octopart.com:443/SMA-J-P-H-ST-TH1-Samtec-datasheet-180264035.pdf?src-supplier=JRH+Electronics; ComponentLink5Description: https://datasheet.octopart.com:443/SMA-J-P-H-ST-TH1-Samtec-datasheet-180264035.pdf?src-supplier=JRH+Electronics; ComponentLink6URL: https://datasheet.octopart.com:443/SMA-J-P-H-ST-TH1-Samtec-datasheet-159753816.pdf?src-supplier=Toby+Electronics; ComponentLink6Description: https://datasheet.octopart.com:443/SMA-J-P-H-ST-TH1-Samtec-datasheet-159753816.pdf?src-supplier=Toby+Electronics; ComponentLink7URL: https://datasheet.octopart.com:443/SMA-J-P-H-ST-TH1-Samtec-datasheet-116536392.pdf?src-supplier=Toby+Electronics; ComponentLink7Description: https://datasheet.octopart.com:443/SMA-J-P-H-ST-TH1-Samtec-datasheet-116536392.pdf?src-supplier=Toby+Electronics; ComponentLink8URL: https://datasheet.octopart.com:443/SMA-J-P-H-ST-TH1-Samtec-datasheet-116536236.pdf?src-supplier=Toby+Electronics; ComponentLink8Description: https://datasheet.octopart.com:443/SMA-J-P-H-ST-TH1-Samtec-datasheet-116536236.pdf?src-supplier=Toby+Electronics
R15 R16 R21 R22 = RES: 100mW Thin Film Resistor ±50ppm/℃ ±0.1% 50Ω 0603 Chip Resistor - Surface Mount ROHS; Manufacturer: Yageo; Manufacturer Part Number: RT0603BRE0750RL; Power Rating: 1/10 W; Temperature Coefficient: 50ppm/°C; Working Voltage: 75V; Tolerance: 0.1%; Package Size: 0603; Supplier: DigiKey; Supplier Part Number: 13-RT0603BRE0750RLCT-ND; RoHS: Compliant; Category: Chip SMD Resistors; Stock: 31948; Pricing: 1=0.1, 10=0.085, 50=0.0746, 100=0.0704, 500=0.06184 (USD); Case/Package: 0603; China RoHS: Non-Compliant; Composition: Thin Film; Country of Origin: Mainland China, Taiwan; Export Control Classification Number (ECCN) Code: EAR99; Features: Moisture Resistant; Height: 558.8µm; Harmonized Tariff Schedule (HTS) Code: 8533.21.00.30; Introduction Date: 2017-09-12; Length: 1.6002mm; Lifecycle Status: Production; Max Operating Temperature: 155°C; Max Power Dissipation: 100mW; Min Operating Temperature: -55°C; Mounting Technology: Surface Mount; Number of Terminals: 2; Number of Terminations: 2; Packaging: Tape & Reel; REACH SVHC: Yes; Value: 50Ω; Width: 787.4µm; ComponentLink1URL: https://datasheet.octopart.com:443/RT0603BRE0750RL-Yageo-datasheet-96443642.pdf?src-supplier=IHS; ComponentLink1Description: https://datasheet.octopart.com:443/RT0603BRE0750RL-Yageo-datasheet-96443642.pdf?src-supplier=IHS; ComponentLink2URL: https://datasheet.octopart.com:443/RT0603BRE0750RL-Yageo-datasheet-176402239.pdf?src-supplier=Future+Electronics; ComponentLink2Description: https://datasheet.octopart.com:443/RT0603BRE0750RL-Yageo-datasheet-176402239.pdf?src-supplier=Future+Electronics; ComponentLink3URL: https://datasheet.octopart.com:443/RT0603BRE0750RL-Yageo-datasheet-169971040.pdf?src-supplier=Future+Electronics; ComponentLink3Description: https://datasheet.octopart.com:443/RT0603BRE0750RL-Yageo-datasheet-169971040.pdf?src-supplier=Future+Electronics; ComponentLink4URL: https://datasheet.octopart.com:443/RT0603BRE0750RL-Yageo-datasheet-166250672.pdf?src-supplier=Future+Electronics; ComponentLink4Description: https://datasheet.octopart.com:443/RT0603BRE0750RL-Yageo-datasheet-166250672.pdf?src-supplier=Future+Electronics; ComponentLink5URL: https://datasheet.octopart.com:443/RT0603BRE0750RL-Yageo-datasheet-137700930.pdf?src-supplier=Future+Electronics; ComponentLink5Description: https://datasheet.octopart.com:443/RT0603BRE0750RL-Yageo-datasheet-137700930.pdf?src-supplier=Future+Electronics; ComponentLink6URL: https://datasheet.octopart.com:443/RT0603BRE0750RL-Yageo-Group-datasheet-141265893.pdf?src-supplier=ODG+(Origin+Data+Global); ComponentLink6Description: https://datasheet.octopart.com:443/RT0603BRE0750RL-Yageo-Group-datasheet-141265893.pdf?src-supplier=ODG+(Origin+Data+Global); ComponentLink7URL: https://datasheet.octopart.com/RT0603BRE0750RL-Yageo-datasheet-86813807.pdf; ComponentLink7Description: https://datasheet.octopart.com/RT0603BRE0750RL-Yageo-datasheet-86813807.pdf; ComponentLink8URL: http://sigma.octopart.com:80/conflict_mineral_statement/Yageo-company-3.pdf?src-supplier=Compliance+Statements; ComponentLink8Description: http://sigma.octopart.com:80/conflict_mineral_statement/Yageo-company-3.pdf?src-supplier=Compliance+Statements; ComponentLink9URL: http://sigma.octopart.com:80/rohs_statement/Yageo-company-2.pdf?src-supplier=Compliance+Statements; ComponentLink9Description: http://sigma.octopart.com:80/rohs_statement/Yageo-company-2.pdf?src-supplier=Compliance+Statements
R17-R20 = RES: Resistor SMD Generic; Manufacturer: *; Manufacturer Part Number: *; Tolerance: *; Package Size: 0603; Voltage Rating: *
U7 = TLV9064IDR: Quad, 5.5-V, 10-MHz, RRIO operational amplifier for cost-optimized applications 14-SOIC -40 to 125; Manufacturer: Texas Instruments; Manufacturer Lifecycle Status: ACTIVE; Bandwidth: 10MHz; Number of Channels: 4; Slew Rate: 6.5V/µs; Manufacturer Part Number: TLV9064IDR; Supplier: DigiKey; Supplier Part Number: 296-47549-1-ND; RoHS: Compliant; Category: Amplifiers - Op Amps, Buffer, Instrumentation; Stock: 4493; Pricing: 1=1.49, 10=1.085, 25=0.9844, 100=0.8739, 250=0.8212, 500=0.78944, 1000=0.76329 (USD); Case/Package: SOIC; Height: 0m; Length: 8.65mm; Lifecycle Status: Production; Max Operating Temperature: 125°C; Min Operating Temperature: -40°C; Pins: 14; Packaging: Cut Tape; Schedule B: 8542330000, 8542330000|8542330000|8542330000|8542330000|8542330000; Thickness: 1.58mm; Width: 3.91mm; ComponentLink1URL: https://sigma.octopart.com:443/182471030/technical_drawing/Texas-Instruments-TLV9064IDR.pdf?src-supplier=Texas+Instruments; ComponentLink1Description: https://sigma.octopart.com:443/182471030/technical_drawing/Texas-Instruments-TLV9064IDR.pdf?src-supplier=Texas+Instruments; ComponentLink2URL: https://octopart.com:443/opatz8j6/c1?t=b8RlzpfQG-h9uOWAabMAiPJWoCTgAwquZzec_BkdV6ZjMU2OI4YyppNX09BT2fM0gpcDMTQrYtgvce6_TtfmK4XZa-h4SQxM8TKEKMrJJktc7O_kAaPT_h62tC27hsW5hQAKMoGbKBjHibz2blvr-fhN1RVl1yW8EvD465A9BJDSrY_kRU3crDNophsG2nTX2Be3i9H2X4Kl0o-rARNMZYxgtWRCQAP9XVS_fu0jqO5PbtSNR57rXOk02X4GKKjnzDeVifR_OIS0uZ1j_pAkmvXspyYvhGUJvwUxZqgyekwRIScv7vrk5hgDM9rgOsgWHAf34DWgZgApfn4NaTTf5ebtlEHCtjJg6ABKjJ4CBoMZf9D-5muRZyk3ZTspSwA1lzBPrFk&src-supplier=Texas+Instruments; ComponentLink2Description: https://octopart.com:443/opatz8j6/c1?t=b8RlzpfQG-h9uOWAabMAiPJWoCTgAwquZzec_BkdV6ZjMU2OI4YyppNX09BT2fM0gpcDMTQrYtgvce6_TtfmK4XZa-h4SQxM8TKEKMrJJktc7O_kAaPT_h62tC27hsW5hQAKMoGbKBjHibz2blvr-fhN1RVl1yW8EvD465A9BJDSrY_kRU3crDNophsG2nTX2Be3i9H2X4Kl0o-rARNMZYxgtWRCQAP9XVS_fu0jqO5PbtSNR57rXOk02X4GKKjnzDeVifR_OIS0uZ1j_pAkmvXspyYvhGUJvwUxZqgyekwRIScv7vrk5hgDM9rgOsgWHAf34DWgZgApfn4NaTTf5ebtlEHCtjJg6ABKjJ4CBoMZf9D-5muRZyk3ZTspSwA1lzBPrFk&src-supplier=Texas+Instruments; ComponentLink3URL: https://sigma.octopart.com:443/49249646/technical_drawing/Texas-Instruments-TLV9064IDR.pdf?src-supplier=Texas+Instruments; ComponentLink3Description: https://sigma.octopart.com:443/49249646/technical_drawing/Texas-Instruments-TLV9064IDR.pdf?src-supplier=Texas+Instruments; ComponentLink4URL: https://datasheet.octopart.com:443/TLV9064IDR-Texas-Instruments-datasheet-101609303.pdf?src-supplier=Farnell; ComponentLink4Description: https://datasheet.octopart.com:443/TLV9064IDR-Texas-Instruments-datasheet-101609303.pdf?src-supplier=Farnell; ComponentLink5URL: https://datasheet.octopart.com:443/TLV9064IDR-Texas-Instruments-datasheet-160738807.pdf?src-supplier=LCSC; ComponentLink5Description: https://datasheet.octopart.com:443/TLV9064IDR-Texas-Instruments-datasheet-160738807.pdf?src-supplier=LCSC; ComponentLink6URL: https://datasheet.octopart.com:443/TLV9064IDR-Texas-Instruments-datasheet-159117845.pdf?src-supplier=LCSC; ComponentLink6Description: https://datasheet.octopart.com:443/TLV9064IDR-Texas-Instruments-datasheet-159117845.pdf?src-supplier=LCSC; ComponentLink7URL: http://sigma.octopart.com:80/reach_statement/Texas-Instruments-company-64.pdf?src-supplier=Compliance+Statements; ComponentLink7Description: http://sigma.octopart.com:80/reach_statement/Texas-Instruments-company-64.pdf?src-supplier=Compliance+Statements; ComponentLink8URL: http://sigma.octopart.com:80/conflict_mineral_statement/Texas-Instruments-company-63.pdf?src-supplier=Compliance+Statements; ComponentLink8Description: http://sigma.octopart.com:80/conflict_mineral_statement/Texas-Instruments-company-63.pdf?src-supplier=Compliance+Statements

## Sheet ADC.SchDoc
size Letter; DrawnBy: Titan Yuan; SheetNumber: 6; SheetTotal: 9
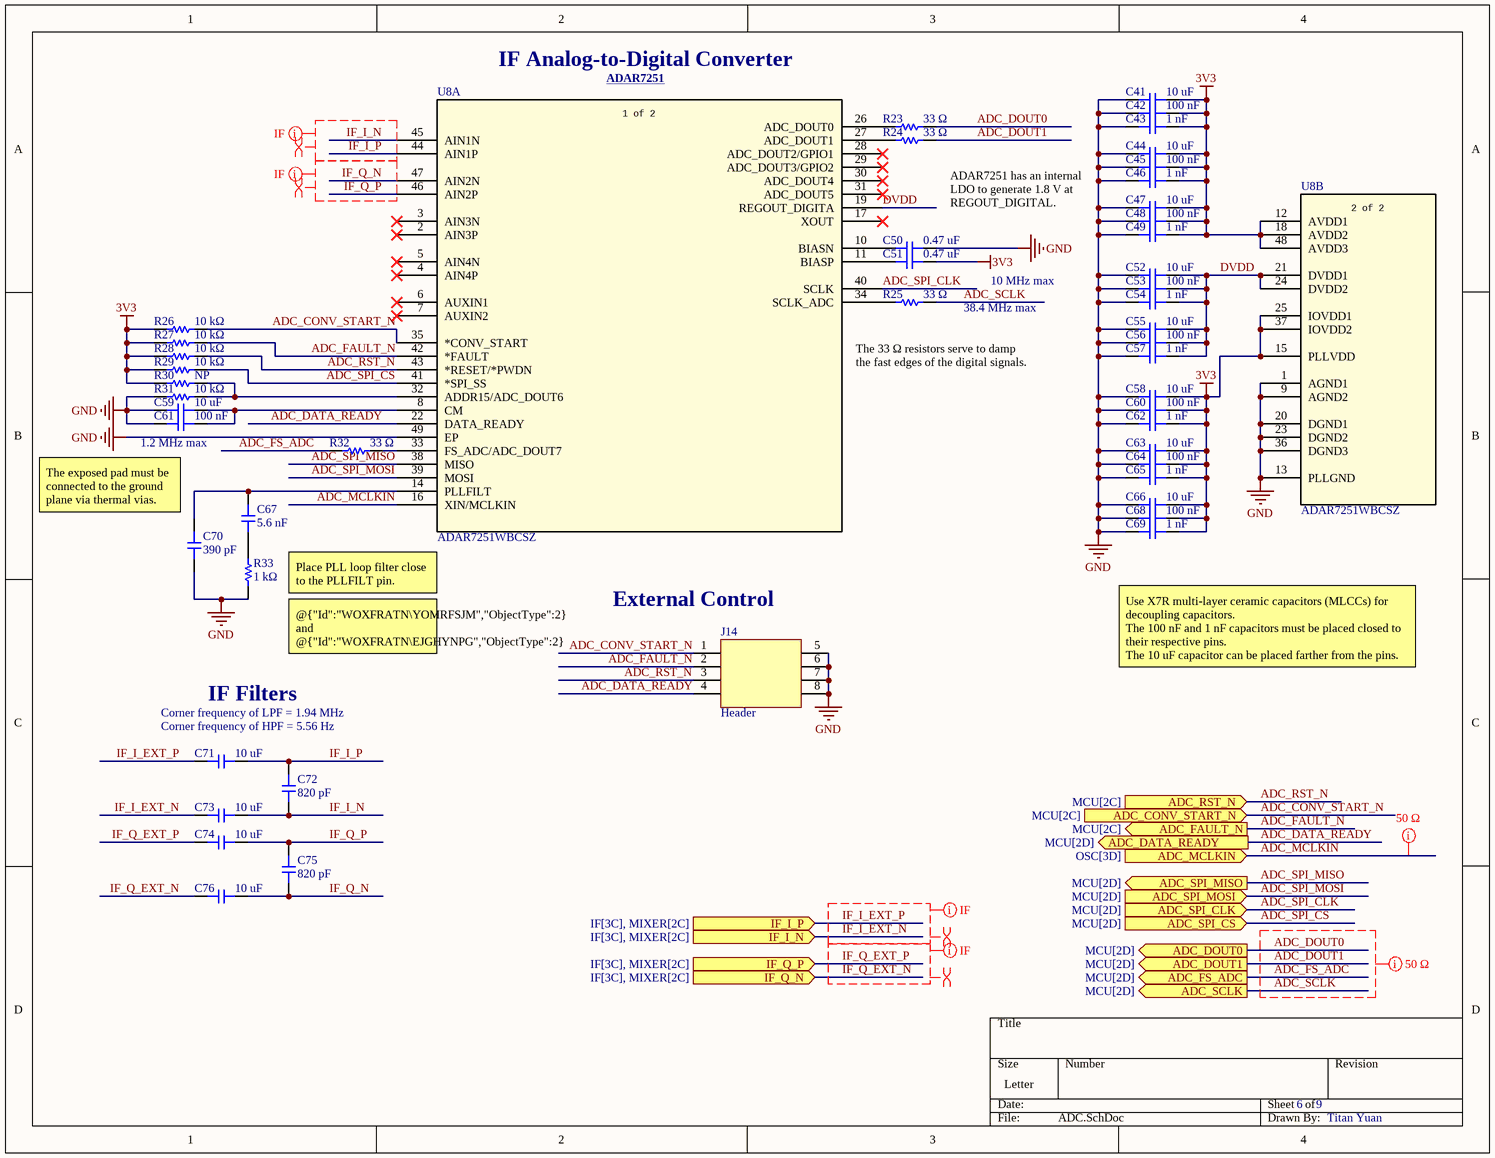
[diagram p5: ADC.SchDoc]

### Parts
C41  10 uF  [CAP_0805]
C42  100 nF  [CAP_0402]
C43  1 nF  [CAP_0402]
C44  10 uF  [CAP_0805]
C45  100 nF  [CAP_0402]
C46  1 nF  [CAP_0402]
C47  10 uF  [CAP_0805]
C48  100 nF  [CAP_0402]
C49  1 nF  [CAP_0402]
C50  0.47 uF  [CAP_0402]
C51  0.47 uF  [CAP_0402]
C52  10 uF  [CAP_0805]
C53  100 nF  [CAP_0402]
C54  1 nF  [CAP_0402]
C55  10 uF  [CAP_0805]
C56  100 nF  [CAP_0402]
C57  1 nF  [CAP_0402]
C58  10 uF  [CAP_0805]
C59  10 uF  [CAP_0805]
C60  100 nF  [CAP_0402]
C61  100 nF  [CAP_0402]
C62  1 nF  [CAP_0402]
C63  10 uF  [CAP_0805]
C64  100 nF  [CAP_0402]
C65  1 nF  [CAP_0402]
C66  10 uF  [CAP_0805]
C67  5.6 nF  [CAP_0402]
C68  100 nF  [CAP_0402]
C69  1 nF  [CAP_0402]
C70  390 pF  [CAP_0402]
C71  10 uF  [CAP_0805]
C72  820 pF  [CAP_0603]
C73  10 uF  [CAP_0805]
C74  10 uF  [CAP_0805]
C75  820 pF  [CAP_0603]
C76  10 uF  [CAP_0805]
J14  Header  [CONN_2x4_2.54mm_PinHeader_Vertical]
R23  33 Ω  [RES_0402]
R24  33 Ω  [RES_0402]
R25  33 Ω  [RES_0402]
R26  10 kΩ  [RES_0402]
R27  10 kΩ  [RES_0402]
R28  10 kΩ  [RES_0402]
R29  10 kΩ  [RES_0402]
R30  NP  [RES_0402]
R31  10 kΩ  [RES_0402]
R32  33 Ω  [RES_0402]
R33  1 kΩ  [RES_0402]
U8  ADAR7251WBCSZ  [CS_48_1_ADI]  (parts A,B of 2)

### Ports
ADC_CONV_START_N (in, see MCU[2C]), ADC_DATA_READY (out, see MCU[2D]), ADC_DOUT0 (out, see MCU[2D]), ADC_DOUT1 (out, see MCU[2D]), ADC_FAULT_N (out, see MCU[2C]), ADC_FS_ADC (out, see MCU[2D]), ADC_MCLKIN (in, see OSC[3D]), ADC_RST_N (in, see MCU[2C]), ADC_SCLK (out, see MCU[2D]), ADC_SPI_CLK (in, see MCU[2D]), ADC_SPI_CS (in, see MCU[2D]), ADC_SPI_MISO (out, see MCU[2D]), ADC_SPI_MOSI (in, see MCU[2D]), IF_I_N (in, see IF[3C], MIXER[2C]), IF_I_P (in, see IF[3C], MIXER[2C]), IF_Q_N (in, see IF[3C], MIXER[2C]), IF_Q_P (in, see IF[3C], MIXER[2C])